# Altium project M4QIDB-PRJ-01.PrjPcb
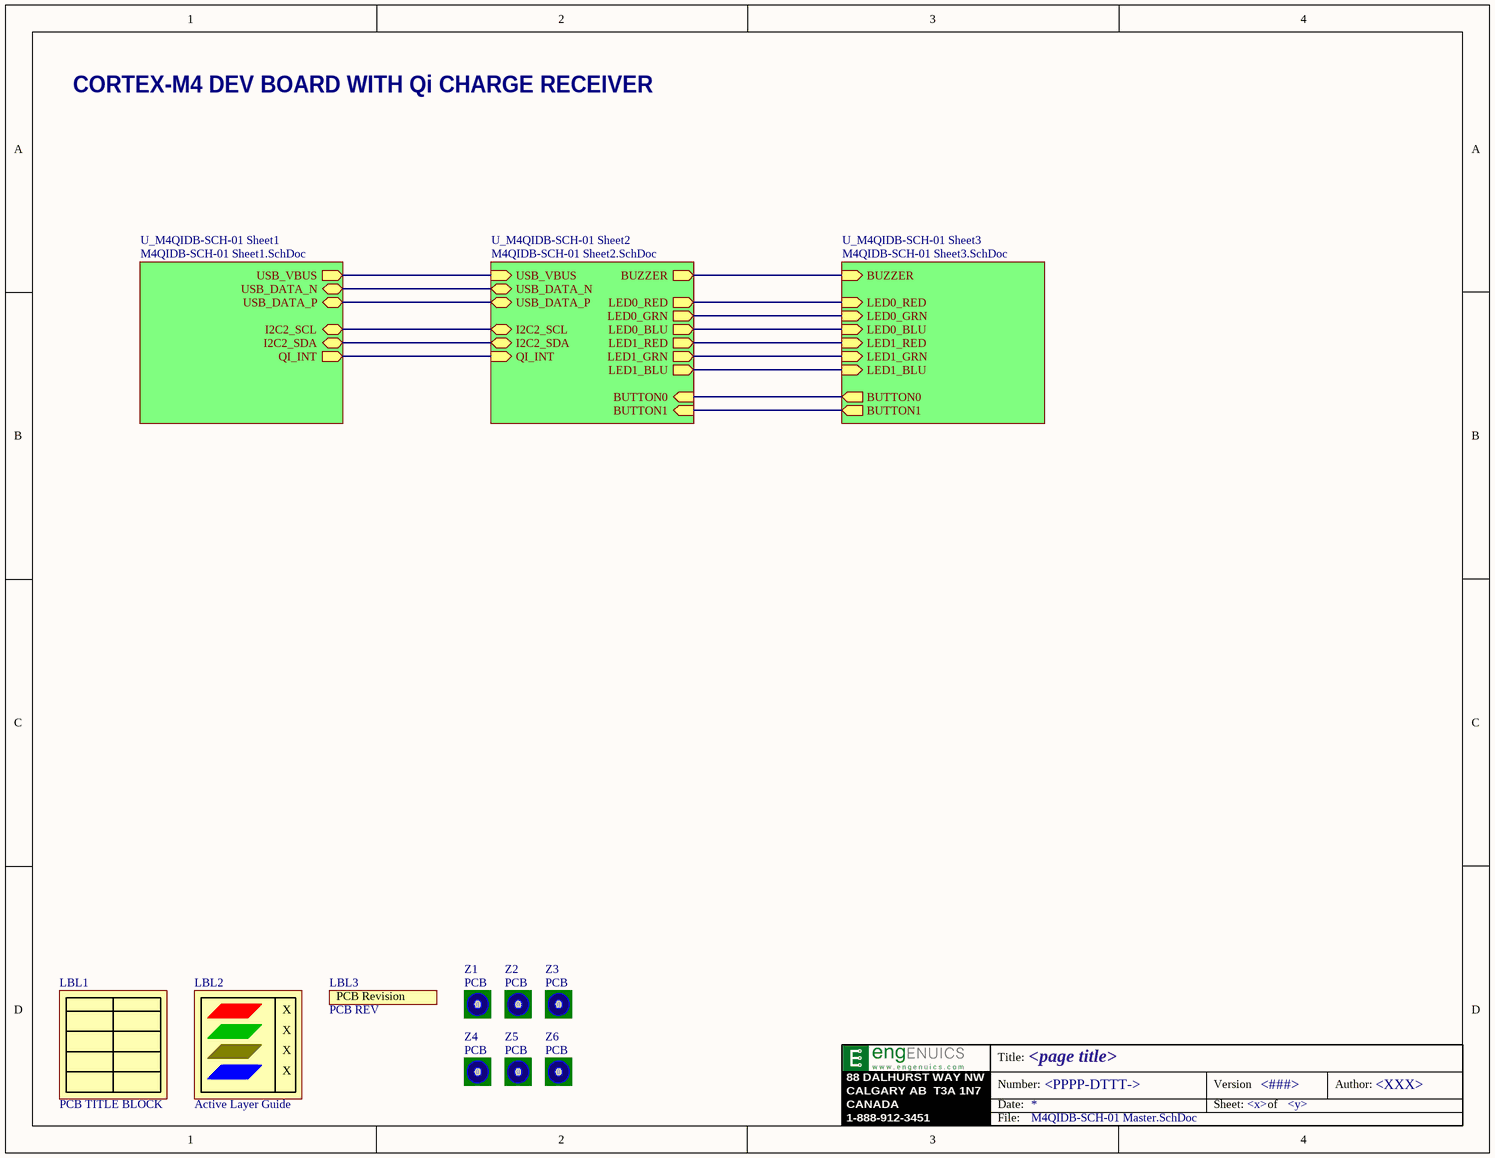
[diagram p0: M4QIDB-SCH-01 Master.SchDoc]
3 sheets, 85 parts. Net scope: hierarchical (ports join the sheet entries above them; power ports are global).
Board file: M4QIDB-PCB-01-DONE.PcbDoc
Sheets:
  M4QIDB-SCH-01 Master.SchDoc
    U_M4QIDB-SCH-01 Sheet1 = M4QIDB-SCH-01 Sheet1.SchDoc
    U_M4QIDB-SCH-01 Sheet2 = M4QIDB-SCH-01 Sheet2.SchDoc

## Sheet M4QIDB-SCH-01 Master.SchDoc: <page title>
size Letter; Author: <XXX>; Organization: Engenuics Technologies Inc; Address1: 88 Dalhurst Way NW; Address2: CALGARY AB; Address3: CANADA T3A 1N7; Address4: 1-888-912-3451; DocumentNumber: <PPPP-DTTT->; Revision: <###>; SheetNumber: <x>; SheetTotal: <y>

### Parts
LBL1  PCB TITLE BLOCK  [LABEL PCB Title Block]  (no BOM)
LBL2  Active Layer Guide  [LABEL PCB ACTIVE LAYERS VERTICAL]  (no BOM)
LBL3  PCB REV  [LABEL PCB REVISION]  (no BOM)
Z1  PCB  [FIDUCIAL PCB]  (no BOM)
Z2  PCB  [FIDUCIAL PCB]  (no BOM)
Z3  PCB  [FIDUCIAL PCB]  (no BOM)
Z4  PCB  [FIDUCIAL PCB]  (no BOM)
Z5  PCB  [FIDUCIAL PCB]  (no BOM)
Z6  PCB  [FIDUCIAL PCB]  (no BOM)

### Sub-sheets
U_M4QIDB-SCH-01 Sheet1 = M4QIDB-SCH-01 Sheet1.SchDoc: USB_DATA_N (bidir), USB_DATA_P (bidir), USB_VBUS (out), I2C2_SCL (bidir), I2C2_SDA (bidir), QI_INT (out)
U_M4QIDB-SCH-01 Sheet2 = M4QIDB-SCH-01 Sheet2.SchDoc: USB_DATA_N (bidir), USB_DATA_P (bidir), USB_VBUS (in), BUZZER (out), BUTTON0 (in), BUTTON1 (in), LED0_RED (out), LED1_RED (out), LED0_BLU (out), LED1_BLU (out), LED0_GRN (out), LED1_GRN (out), I2C2_SCL (bidir), I2C2_SDA (bidir), QI_INT (in)
U_M4QIDB-SCH-01 Sheet3 = M4QIDB-SCH-01 Sheet3.SchDoc (file not in this document): BUTTON1 (out), BUTTON0 (out), LED0_RED (in), LED1_RED (in), LED0_BLU (in), LED1_BLU (in), LED0_GRN (in), LED1_GRN (in), BUZZER (in)

### Nets
BUTTON0: sheet U_M4QIDB-SCH-01 Sheet2/BUTTON0, sheet U_M4QIDB-SCH-01 Sheet3/BUTTON0
BUTTON1: sheet U_M4QIDB-SCH-01 Sheet2/BUTTON1, sheet U_M4QIDB-SCH-01 Sheet3/BUTTON1
BUZZER: sheet U_M4QIDB-SCH-01 Sheet2/BUZZER, sheet U_M4QIDB-SCH-01 Sheet3/BUZZER
I2C2_SCL: sheet U_M4QIDB-SCH-01 Sheet1/I2C2_SCL, sheet U_M4QIDB-SCH-01 Sheet2/I2C2_SCL
I2C2_SDA: sheet U_M4QIDB-SCH-01 Sheet1/I2C2_SDA, sheet U_M4QIDB-SCH-01 Sheet2/I2C2_SDA
LED0_BLU: sheet U_M4QIDB-SCH-01 Sheet2/LED0_BLU, sheet U_M4QIDB-SCH-01 Sheet3/LED0_BLU
LED0_GRN: sheet U_M4QIDB-SCH-01 Sheet2/LED0_GRN, sheet U_M4QIDB-SCH-01 Sheet3/LED0_GRN
LED0_RED: sheet U_M4QIDB-SCH-01 Sheet2/LED0_RED, sheet U_M4QIDB-SCH-01 Sheet3/LED0_RED
LED1_BLU: sheet U_M4QIDB-SCH-01 Sheet2/LED1_BLU, sheet U_M4QIDB-SCH-01 Sheet3/LED1_BLU
LED1_GRN: sheet U_M4QIDB-SCH-01 Sheet2/LED1_GRN, sheet U_M4QIDB-SCH-01 Sheet3/LED1_GRN
LED1_RED: sheet U_M4QIDB-SCH-01 Sheet2/LED1_RED, sheet U_M4QIDB-SCH-01 Sheet3/LED1_RED
QI_INT: sheet U_M4QIDB-SCH-01 Sheet1/QI_INT, sheet U_M4QIDB-SCH-01 Sheet2/QI_INT
USB_DATA_N: sheet U_M4QIDB-SCH-01 Sheet1/USB_DATA_N, sheet U_M4QIDB-SCH-01 Sheet2/USB_DATA_N
USB_DATA_P: sheet U_M4QIDB-SCH-01 Sheet1/USB_DATA_P, sheet U_M4QIDB-SCH-01 Sheet2/USB_DATA_P
USB_VBUS: sheet U_M4QIDB-SCH-01 Sheet1/USB_VBUS, sheet U_M4QIDB-SCH-01 Sheet2/USB_VBUS

### Notes on the sheet
- CORTEX-M4 DEV BOARD WITH Qi CHARGE RECEIVER
- 88 DALHURST WAY NW
- CALGARY AB  T3A 1N7
- CANADA
- Title:
- Number:
- Date:
- Version
- Sheet:
- of
- Author:
- 1-888-912-3451
- File:
- (in symbol LABEL PCB ACTIVE LAYERS) X
- (in symbol LABEL PCB REVISION) PCB Revision

### Library data of the parts
LBL1 = LABEL PCB TITLE BLOCK: 1. Description: LABEL PCB TITLE BLOCK
LBL2 = LABEL PCB ACTIVE LAYERS: 1. Description: LABEL PCB ACTIVE LAYERS; 6. Last Modified: *; 7. Modified By: *
LBL3 = LABEL PCB REVISION: 1. Description: LABEL PCB ENGENUICS
Z1-Z6 = FIDUCIAL PCB: 1. Description: FIDUCIAL SINGLE LAYER PADS ONLY; 2. Manufacturer: *; 3. Manufacturer Part Number: *; 4. Digi-Key Part Number: *

## Sheet M4QIDB-SCH-01 Sheet1.SchDoc: Power supply, Qi Charger
size Letter; Author: JRL; Organization: Engenuics Technologies Inc; Address1: 88 Dalhurst Way NW; Address2: CALGARY AB; Address3: CANADA T3A 1N7; Address4: 1-888-912-3451; DocumentNumber: M4QIDB-SCH; Revision: 01; SheetNumber: 1; SheetTotal: 3
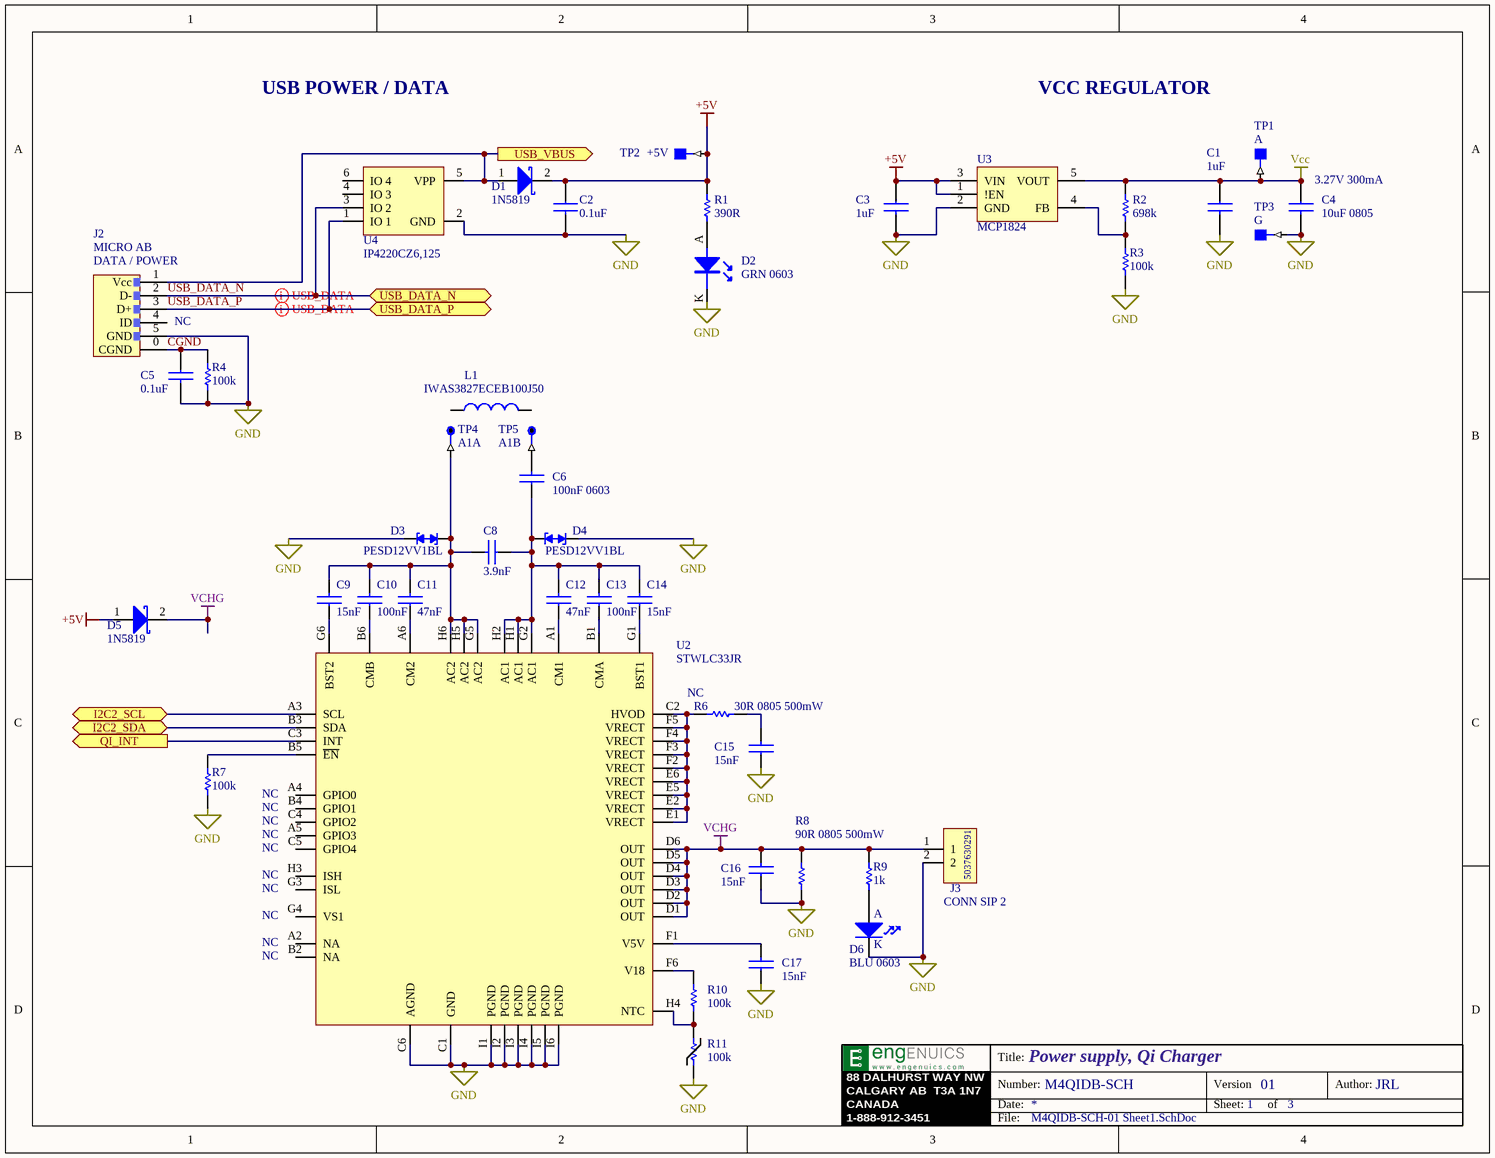
[diagram p1: M4QIDB-SCH-01 Sheet1.SchDoc]

### Parts
C1  1uF  [0603 CAP3D]
C2  0.1uF  [0603 CAP3D]
C3  1uF  [0603 CAP3D]
C4  10uF 0805  [0805 CAP3D]
C5  0.1uF  [0603 CAP3D]
C6  100nF 0603  [0603 CAP3D]
C8  3.9nF  [0603 CAP3D]
C9  15nF  [0603 CAP3D]
C10  100nF  [0603 CAP3D]
C11  47nF  [0603 CAP3D]
C12  47nF  [0603 CAP3D]
C13  100nF  [0603 CAP3D]
C14  15nF  [0603 CAP3D]
C15  15nF  [0603 CAP3D]
C16  15nF  [0603 CAP3D]
C17  15nF  [0603 CAP3D]
D1  1N5819  [SOD123]
D2  GRN 0603  [0603 AK]
D3  PESD12VV1BL  [SOD882]
D4  PESD12VV1BL  [SOD882]
D5  1N5819  [SOD123]
D6  BLU 0603  [0603 AK]
J2  MICRO AB  [CONN USB MICRO B SMT LEGS FCI 10118193]
J3  CONN SIP 2  [HDR1X2]
L1  IWAS3827ECEB100J50  [HDR1X2 NP]  (mechanical)
R1  390R  [0603]
R2  698k  [0603]
R3  100k  [0603]
R4  100k  [0603]
R6  30R 0805 500mW  [0805]
R7  100k  [0603]
R8  90R 0805 500mW  [0805]
R9  1k  [0603]
R10  100k  [0603]
R11  100k  [0603]
TP1  A  [TEST POINT SMT]  (no BOM)
TP2  +5V  [TEST POINT SMT]  (no BOM)
TP3  G  [TEST POINT SMT]  (no BOM)
TP4  A1A  [TEST POINT THRU HOLE]  (no BOM)
TP5  A1B  [TEST POINT THRU HOLE]  (no BOM)
U2  STWLC33JR  [FLIP CHIP 3.97x2.67mm]
U3  MCP1824  [SOT23-5]
U4  IP4220CZ6,125  [TSOP95P280X110-6N]

### Ports
I2C2_SCL (bidir), I2C2_SDA (bidir), QI_INT (out), USB_DATA_N (bidir), USB_DATA_P (bidir), USB_VBUS (out)

### Nets
+5V: C2.1 C3.1 D1.2 D5.1 R1.2 TP2.1 U3.1(!EN) U3.3(VIN)
GND: C1.2 C2.2 C3.2 C4.2 C5.2 C15.1 C16.1 C17.1 D2.K(K1) D3.2 D4.2 D6.K J2.5(GND) J3.2 R3.2 R4.1 R7.2 R8.2 R11.2 TP3.1 U2.C1(GND) U2.C6(AGND) U2.I1(PGND) U2.I2(PGND) U2.I3(PGND) U2.I4(PGND) U2.I5(PGND) U2.I6(PGND) U3.2(GND) U4.2(GND)
Vcc: C1.1 C4.1 R2.2 TP1.1 U3.5(VOUT)
VCHG: C16.2 D5.2 J3.1 R8.1 R9.1 U2.D1(OUT) U2.D2(OUT) U2.D3(OUT) U2.D4(OUT) U2.D5(OUT) U2.D6(OUT)
CGND: C5.1 J2.0(CGND) R4.2
I2C2_SCL: U2.A3(SCL) ; port I2C2_SCL
I2C2_SDA: U2.B3(SDA) ; port I2C2_SDA
QI_INT: U2.C3(INT) ; port QI_INT
USB_DATA_N: J2.2(D-) U4.3(IO_2) ; port USB_DATA_N
USB_DATA_P: J2.3(D+) U4.1(IO_1) ; port USB_DATA_P
USB_VBUS: D1.1 J2.1(Vcc) U4.5(VPP) ; port USB_VBUS
NetC6_1: C6.1 C8.1 C12.2 C13.2 C14.2 D4.1 U2.G2(AC1) U2.H1(AC1) U2.H2(AC1)
NetC6_2: C6.2 TP5.1
NetC8_2: C8.2 C9.2 C10.2 C11.2 D3.1 TP4.1 U2.G5(AC2) U2.H5(AC2) U2.H6(AC2)
NetC9_1: C9.1 U2.G6(BST2)
NetC10_1: C10.1 U2.B6(CMB)
NetC11_1: C11.1 U2.A6(CM2)
NetC12_1: C12.1 U2.A1(CM1)
NetC13_1: C13.1 U2.B1(CMA)
NetC14_1: C14.1 U2.G1(BST1)
NetC15_2: C15.2 R6.2
NetC17_2: C17.2 U2.F1(V5V)
NetD2_A: D2.A(A1) R1.1
NetD6_A: D6.A R9.2
NetR2_1: R2.1 R3.1 U3.4(FB)
NetR6_1: R6.1 U2.C2(HVOD) U2.E1(VRECT) U2.E2(VRECT) U2.E5(VRECT) U2.E6(VRECT) U2.F2(VRECT) U2.F3(VRECT) U2.F4(VRECT) U2.F5(VRECT)
NetR7_1: R7.1 U2.B5(~{EN})
NetR10_1: R10.1 U2.F6(V18)
NetR10_2: R10.2 R11.1 U2.H4(NTC)

Not connected (* = marked no-connect by the designer): J2 4(ID); L1 1 2; U2 A2(NA) A4(GPIO0) A5(GPIO3) B2(NA) B4(GPIO1) C4(GPIO2) C5(GPIO4) G3(ISL) G4(VS1) H3(ISH); U4 4(IO_3) 6(IO_4)

### Layout directives
differential pair: USB_DATA_N, USB_DATA_P

### Notes on the sheet
- USB POWER / DATA
- VCC REGULATOR
- (near C4) 3.27V 300mA
- (near J2) DATA / POWER
- NC
- (near R6) NC
- (near U2) NC
- 88 DALHURST WAY NW
- CALGARY AB  T3A 1N7
- CANADA
- Title:
- Number:
- Date:
- Version
- Sheet:
- of
- Author:
- 1-888-912-3451
- File:

### Library data of the parts
C1 C3 = CAPACITOR NON-POLARIZED: 3. Manufacturer Part Number: EMK107BJ105KA-T; 2. Manufacturer: Taiyo; 5. Internal Part Number: 100009; 1. Description: CAP CER 1uF 10% X5R 16V 0603 SMT; 7. Modified By: JRL; 4. Digi-Key Part Number: 587-1251-2-ND; 6. Last Modified: 2016-08-04
C2 C5 = CAPACITOR NON-POLARIZED: 3. Manufacturer Part Number: C1608X7R1E104K; 2. Manufacturer: TDK; 5. Internal Part Number: 100130; 1. Description: CAP CER 0.1uF 10% X5R 25V 0603 SMT; 7. Modified By: JRL; 4. Digi-Key Part Number: 445-1316-2-ND; 6. Last Modified: 2016-08-04
C4 = CAPACITOR NON-POLARIZED: 3. Manufacturer Part Number: CL21A106KOQNNNE; 2. Manufacturer: Samsung; 5. Internal Part Number: 100006; 1. Description: CAP CER 10uF 10% 16V X5R 0805; 7. Modified By: JRL; 4. Digi-Key Part Number: 1276-1096-1-ND; 6. Last Modified: 2016-08-04
C6 = CAPACITOR NON-POLARIZED: 3. Manufacturer Part Number: CC0603KRX7R9BB473; 2. Manufacturer: Yageo; 1. Description: CAP CER 0.047UF 50V X7R 0603; 7. Modified By: JRL; 5. Internal Part Number: *; 4. Digi-Key Part Number: 311-1427-2-ND; 6. Last Modified: 2019-01-20
C8 = CAPACITOR NON-POLARIZED: 3. Manufacturer Part Number: CAP CER 3900PF 50V X7R 0402 NEED CROSS; 2. Manufacturer: Murata Electronics North America; 1. Description: CAP CER 3900PF 50V X7R 0402; 7. Modified By: JRL; 5. Internal Part Number: *; 4. Digi-Key Part Number: 490-1307-2-ND; 6. Last Modified: 2019-01-20
C9 C14-C17 = CAPACITOR NON-POLARIZED: 3. Manufacturer Part Number: C0402C153K8PACTU; 2. Manufacturer: KEMET; 1. Description: CAP CER 0.015UF 10V X5R 0402; 7. Modified By: JRL; 5. Internal Part Number: *; 4. Digi-Key Part Number: 399-3011-2-ND; 6. Last Modified: 2019-01-20
C10 C13 = CAPACITOR NON-POLARIZED: 3. Manufacturer Part Number: GRM155R61H104KE14D; 2. Manufacturer: Murata Electronics North America; 1. Description: CAP CER 0.1UF 50V X5R 0402; 7. Modified By: JRL; 5. Internal Part Number: *; 4. Digi-Key Part Number: 490-10697-2-ND; 6. Last Modified: 2019-01-20
C11 C12 = CAPACITOR NON-POLARIZED: 3. Manufacturer Part Number: GRM155R61H473KE19 NEED CROSS; 2. Manufacturer: Murata Electronics North America; 1. Description: CAP CER 0.047UF 50V X5R 0402; 7. Modified By: JRL; 5. Internal Part Number: *; 4. Digi-Key Part Number: 490-12705-2-ND; 6. Last Modified: 2019-01-20
D1 D5 = DIODE SCHOTTKY: 2. Manufacturer: Diodes Inc.; 3. Manufacturer Part Number: 1N5819HW-7-F; 5. Internal Part Number: 100039; 1. Description: DIODE SCHOTTKY 1A 40V SOD123; 7. Modified By: JRL; 4. Digi-Key Part Number: 1N5819HW-FDITR-ND; 6. Last Modified: 2016-08-04
D2 = LED T1-3/4: LED; 2. Manufacturer: Kingbright Corp; 3. Manufacturer Part Number: APT1608SGC; 5. Internal Part Number: 100065; 1. Description: LED 0603 GREEN CLEAR SMD; 7. Modified By: JRL; 4. Digi-Key Part Number: 754-1121-2-ND; 6. Last Modified: 2016-08-04
D3 D4 = DIODE ESD PESD12VVBL: 2. Manufacturer: Nexperia USA Inc.; 3. Manufacturer Part Number: PESD12VV1BL,315; 1. Description: TVS DIODE 12V 38V DFN1006-2; 7. Modified By: JRL; 4. Digi-Key Part Number: 1727-1304-2-ND; 5. Internal Part Number: *; 6. Last Modified: 2019-01-20
D6 = LED AK: 2. Manufacturer: Kingbright; 3. Manufacturer Part Number: APT1608QBC/D; 5. Internal Part Number: 100107; 1. Description: LED 0603 BLUE 470NM WTR CLR SMD; 7. Modified By: JRL; 4. Digi-Key Part Number: 754-1434-1-ND; 6. Last Modified: 2019-01-20
J2 = CONN USB MICRO AB FCI 10104111: 2. Manufacturer: FCI; 3. Manufacturer Part Number: 10104111-0001LF; 5. Internal Part Number: 100182; 1. Description: CONN RCPT STD MICRO USB TYPE AB; 7. Modified By: JRL; 4. Digi-Key Part Number: 609-4053-1-ND; 6. Last Modified: 2012-09-03
J3 = CONN 2POS MOLEX 5037630291: 2. Manufacturer: MOLEX; 1. Description: CONN HEADER 1MM R/A 2CKT; 7. Modified By: JRL; 3. Manufacturer Part Number: 5037630291; 4. Digi-Key Part Number: WM10654TR-ND; 5. Internal Part Number: *; 6. Last Modified: 2015-12-08
L1 = INDUCTOR: 1. Description: INDUCTOR [TYPE] [VALUE] [TOLERANCE] [PACKAGE] [CURRENT] [DCR]; 2. Manufacturer: *; 3. Manufacturer Part Number: *; 4. Digi-Key Part Number: *; 5. Internal Part Number: *; 6. Last Modified: *; 7. Modified By: *
R1 = RESISTOR: 2. Manufacturer: Yageo; 3. Manufacturer Part Number: RC0603FR-07390RL; 5. Internal Part Number: 100098; 1. Description: RES 390 OHM 1/10W 1% 0603; 7. Modified By: JRL; 4. Digi-Key Part Number: 311-390HRTR-ND; 6. Last Modified: 2013-06-26
R2 = RESISTOR: 2. Manufacturer: Yageo; 3. Manufacturer Part Number: RC0603FR-07698KL; 1. Description: RES 698K OHM 1/10W 1% 0603 SMD; 7. Modified By: JRL; 4. Digi-Key Part Number: 311-698KHRCT-ND; 6. Last Modified: 2011-08-14
R3 R4 = RESISTOR: 2. Manufacturer: Yageo; 3. Manufacturer Part Number: RC0603FR-07100KL; 5. Internal Part Number: 100078; 1. Description: RES 100K OHM 1/10W 1% 0603 SMD; 7. Modified By: JRL; 4. Digi-Key Part Number: 311-100KHRTR-ND; 6. Last Modified: 2016-08-04
R6 R8 = RESISTOR: 2. Manufacturer: Panasonic Electronic Components; 3. Manufacturer Part Number: ERJ-P6WF30R0V; 1. Description: RES SMD 30 OHM 1% 1/2W 0805; 7. Modified By: JRL; 5. Internal Part Number: *; 4. Digi-Key Part Number: ERJ-P6WF30R0V-ND; 6. Last Modified: 2018-11-22
R7 R9-R11 = RESISTOR: 1. Description: RES [VALUE] [POWER] [TOLERANCE] [PACKAGE] [CONSTRUCTION]; 5. Internal Part Number: *; 4. Digi-Key Part Number: *; 2. Manufacturer: *; 3. Manufacturer Part Number: *; 6. Last Modified: *; 7. Modified By: *
TP1-TP3 = TEST POINT SMT: 1. Description: Test pad; 7. Modified By: JRL; 2. Manufacturer: N/A; 3. Manufacturer Part Number: N/A; 4. Digi-Key Part Number: N/A
  TP1 TP3: 6. Last Modified: 2012-12-16
  TP2: 5. Internal Part Number: N/A; 6. Last Modified: June 12, 2008
TP4 TP5 = TEST POINT THRU HOLE: 1. Description: TEST PAD THROUGH-HOLE; 7. Modified By: JRL; 2. Manufacturer: N/A; 3. Manufacturer Part Number: N/A; 4. Digi-Key Part Number: N/A; 5. Internal Part Number: N/A; 6. Last Modified: June 12, 2008
U2 = IC WIRESLESS CHARGER STWLC33JR: 2. Manufacturer: STM; 1. Description: IC WIRELESS POWER RECEIVER 52CSP; 7. Modified By: JRL; 3. Manufacturer Part Number: STWLC33JR; 4. Digi-Key Part Number: 497-17649-2-ND; 5. Internal Part Number: *; 6. Last Modified: 2019-01-20
U3 = VREG MCP1824: 2. Manufacturer: Microchip; 3. Manufacturer Part Number: MCP1824T-ADJE/OT; 1. Description: IC LDO REG 300MA ADJ-V SOT23-5; 7. Modified By: JRL; 4. Digi-Key Part Number: MCP1824T-ADJE/OTCT-ND; 6. Last Modified: 2011-08-14
U4 = IC ESD USB DUAL NXP IP4220CZ6: 2. Manufacturer: NXP; 5. Internal Part Number: 100225; 1. Description: IC USB DUAL ESD PROTECT 6TSOP; 7. Modified By: JRL; 3. Manufacturer Part Number: IP4220CZ6,125; 4. Digi-Key Part Number: 568-3529-6-ND; 6. Last Modified: 2013-05-14

## Sheet M4QIDB-SCH-01 Sheet2.SchDoc: Microcontroller
size Letter; Author: JRL; Organization: Engenuics Technologies Inc; Address1: 88 Dalhurst Way NW; Address2: CALGARY AB; Address3: CANADA T3A 1N7; Address4: 1-888-912-3451; DocumentNumber: M4QIDB-SCH; Revision: 1; SheetNumber: 2; SheetTotal: 3
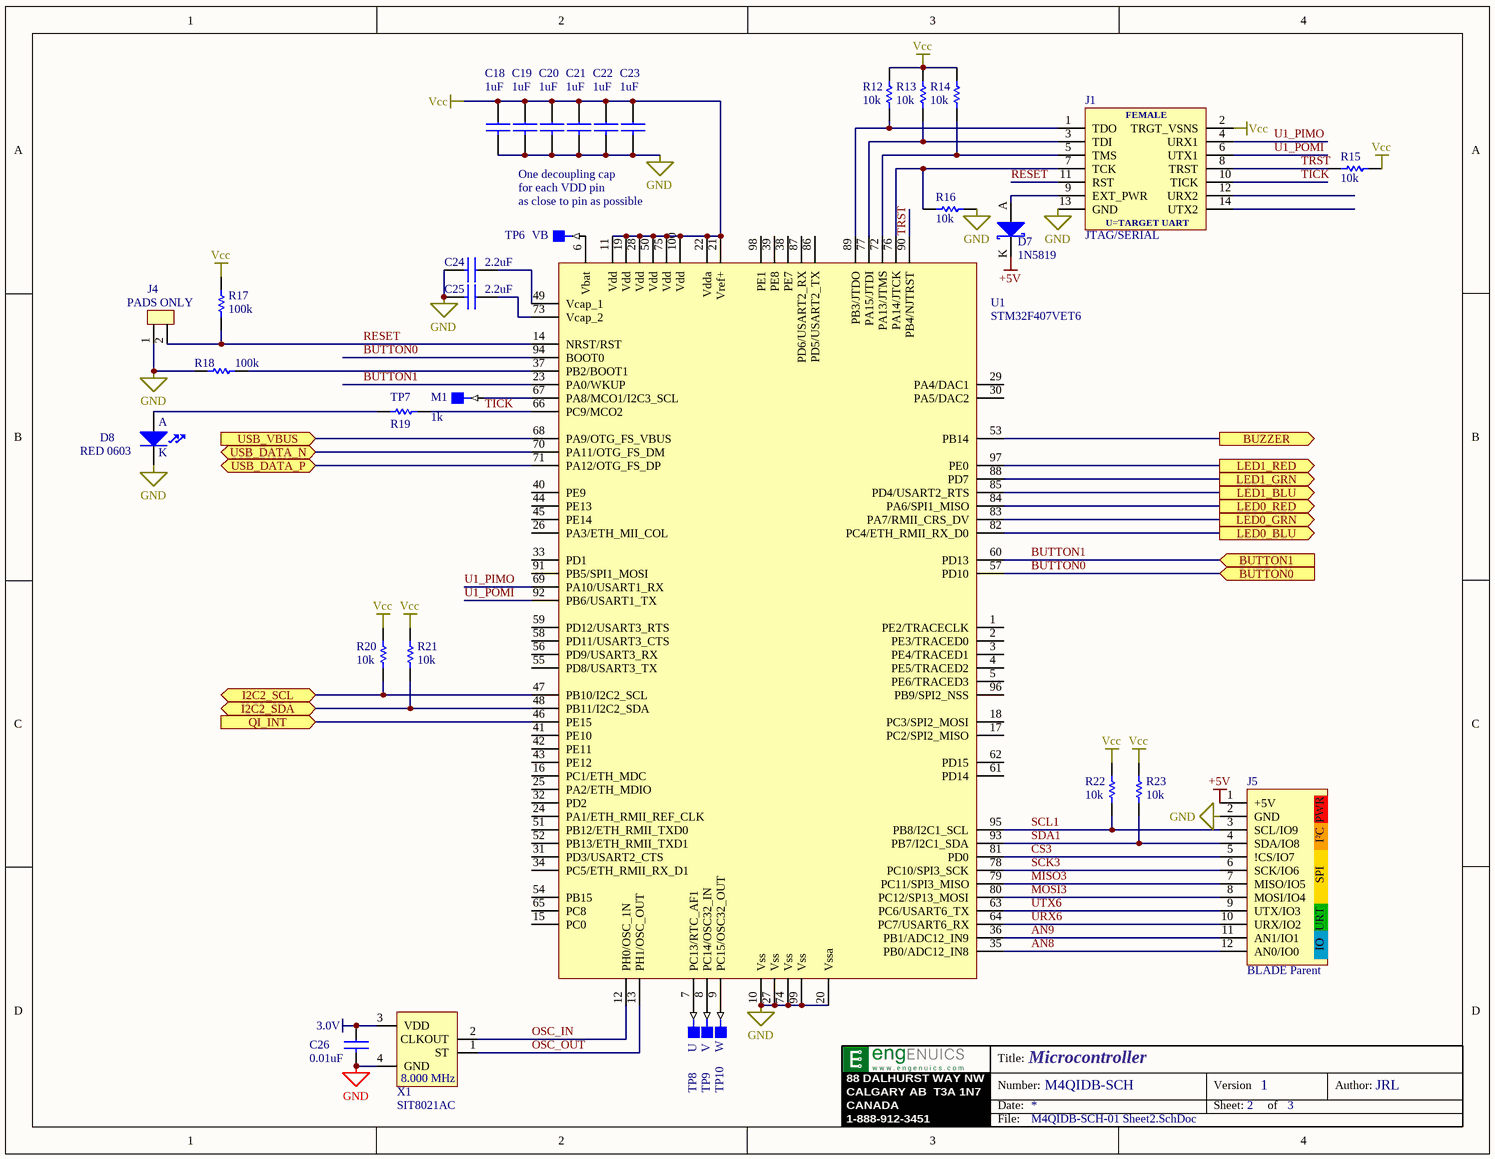
[diagram p2: M4QIDB-SCH-01 Sheet2.SchDoc]

### Parts
C18  1uF  [0603 CAP3D]
C19  1uF  [0603 CAP3D]
C20  1uF  [0603 CAP3D]
C21  1uF  [0603 CAP3D]
C22  1uF  [0603 CAP3D]
C23  1uF  [0603 CAP3D]
C24  2.2uF  [0603 CAP3D]
C25  2.2uF  [0603 CAP3D]
C26  0.01uF  [0603 CAP3D]
D7  1N5819  [SOD123 AK]
D8  RED 0603  [0603 AK]
J1  JTAG/SERIAL  [CONN 14POS 7X2 SMT FEMALE]
J4  PADS ONLY  [HDR1X2]  (no BOM)
J5  BLADE Parent  [HDR1X12 ENGENUICS PARENT]
R12  10k  [0603]
R13  10k  [0603]
R14  10k  [0603]
R15  10k  [0603]
R16  10k  [0603]
R17  100k  [0603]
R18  100k  [0603]
R19  1k  [0603]
R20  10k  [0603]
R21  10k  [0603]
R22  10k  [0603]
R23  10k  [0603]
TP6  VB  [TEST POINT SMT]  (no BOM)
TP7  M1  [TEST POINT SMT]  (no BOM)
TP8  U  [TEST POINT SMT]  (no BOM)
TP9  V  [TEST POINT SMT]  (no BOM)
TP10  W  [TEST POINT SMT]  (no BOM)
U1  STM32F407VET6  [LQFP100]
X1  SIT8021AC  [CSP 1.55mm x 0.85mm]

### Ports
BUTTON0 (in), BUTTON1 (in), BUZZER (out), I2C2_SCL (bidir), I2C2_SDA (bidir), LED0_BLU (out), LED0_GRN (out), LED0_RED (out), LED1_BLU (out), LED1_GRN (out), LED1_RED (out), QI_INT (in), USB_DATA_N (bidir), USB_DATA_P (bidir), USB_VBUS (in)

### Nets
3.0V: C26.1 X1.3(VDD)
+5V: D7.K J5.1(+5V)
GND: C18.2 C19.2 C20.2 C21.2 C22.2 C23.2 C24.2 C25.2 C26.2 D8.K J1.13(GND) J4.1 J5.2(GND) R16.1 R18.2 U1.10(Vss) U1.20(Vssa) U1.27(Vss) U1.74(Vss) U1.99(Vss) X1.4(GND)
Vcc: C18.1 C19.1 C20.1 C21.1 C22.1 C23.1 J1.2(TRGT_VSNS) R12.2 R13.2 R14.2 R15.1 R17.2 R20.2 R21.2 R22.2 R23.2 U1.11(Vdd) U1.19(Vdd) U1.21(Vref+) U1.22(Vdda) U1.28(Vdd) U1.50(Vdd) U1.75(Vdd) U1.100(Vdd)
AN8: J5.12(AN0/IO0) U1.35(PB0/ADC12_IN8)
AN9: J5.11(AN1/IO1) U1.36(PB1/ADC12_IN9)
BUTTON0: U1.57(PD10) U1.94(BOOT0) ; port BUTTON0
BUTTON1: U1.23(PA0/WKUP) U1.60(PD13) ; port BUTTON1
BUZZER: U1.53(PB14) ; port BUZZER
CS3: J5.5(!CS/IO7) U1.81(PD0)
I2C2_SCL: R20.1 U1.47(PB10/I2C2_SCL) ; port I2C2_SCL
I2C2_SDA: R21.1 U1.48(PB11/I2C2_SDA) ; port I2C2_SDA
LED0_BLU: U1.82(PC4/ETH_RMII_RX_D0) ; port LED0_BLU
LED0_GRN: U1.83(PA7/RMII_CRS_DV) ; port LED0_GRN
LED0_RED: U1.84(PA6/SPI1_MISO) ; port LED0_RED
LED1_BLU: U1.85(PD4/USART2_RTS) ; port LED1_BLU
LED1_GRN: U1.88(PD7) ; port LED1_GRN
LED1_RED: U1.97(PE0) ; port LED1_RED
MISO3: J5.7(MISO/IO5) U1.79(PC11/SPI3_MISO)
MOSI3: J5.8(MOSI/IO4) U1.80(PC12/SP13_MOSI)
OSC_IN: U1.12(PH0/OSC_1N) X1.2(CLKOUT)
OSC_OUT: U1.13(PH1/OSC_OUT) X1.1(ST)
QI_INT: U1.46(PE15) ; port QI_INT
RESET: J1.11(RST) J4.2 R17.1 U1.14(NRST/RST)
SCK3: J5.6(SCK/IO6) U1.78(PC10/SPI3_SCK)
SCL1: J5.3(SCL/IO9) R22.1 U1.95(PB8/I2C1_SCL)
SDA1: J5.4(SDA/IO8) R23.1 U1.93(PB7/I2C1_SDA)
TICK: J1.10(TICK) R19.2 U1.66(PC9/MCO2)
TRST: J1.8(TRST) R15.2 U1.90(PB4/NJTRST)
U1_PIMO: J1.4(URX1) U1.69(PA10/USART1_RX)
U1_POMI: J1.6(UTX1) U1.92(PB6/USART1_TX)
URX6: J5.10(URX/IO2) U1.64(PC7/USART6_RX)
USB_DATA_N: U1.70(PA11/OTG_FS_DM) ; port USB_DATA_N
USB_DATA_P: U1.71(PA12/OTG_FS_DP) ; port USB_DATA_P
USB_VBUS: U1.68(PA9/OTG_FS_VBUS) ; port USB_VBUS
UTX6: J5.9(UTX/IO3) U1.63(PC6/USART6_TX)
NetC24_1: C24.1 U1.49(Vcap_1)
NetC25_1: C25.1 U1.73(Vcap_2)
NetD7_A: D7.A J1.9(EXT_PWR)
NetD8_A: D8.A R19.1
NetJ1_1: J1.1(TDO) R12.1 U1.89(PB3/JTDO)
NetJ1_3: J1.3(TDI) R13.1 U1.77(PA15/JTDI)
NetJ1_5: J1.5(TMS) R14.1 U1.72(PA13/JTMS)
NetJ1_7: J1.7(TCK) R16.2 U1.76(PA14/JTCK)
NetR18_1: R18.1 U1.37(PB2/BOOT1)
NetTP6_1: TP6.1 U1.6(Vbat)
NetTP7_1: TP7.1 U1.67(PA8/MCO1/I2C3_SCL)
NetTP8_1: TP8.1 U1.7(PC13/RTC_AF1)
NetTP9_1: TP9.1 U1.8(PC14/OSC32_IN)
NetTP10_1: TP10.1 U1.9(PC15/OSC32_OUT)

Not connected (* = marked no-connect by the designer): J1 12(URX2) 14(UTX2); U1 1(PE2/TRACECLK) 2(PE3/TRACED0) 3(PE4/TRACED1) 4(PE5/TRACED2) 5(PE6/TRACED3) 15(PC0) 16(PC1/ETH_MDC) 17(PC2/SPI2_MISO) 18(PC3/SPI2_MOSI) 24(PA1/ETH_RMII_REF_CLK) 25(PA2/ETH_MDIO) 26(PA3/ETH_MII_COL) 29(PA4/DAC1) 30(PA5/DAC2) 31(PD3/USART2_CTS) 32(PD2) 33(PD1) 34(PC5/ETH_RMII_RX_D1) 38(PE7) 39(PE8) 40(PE9) 41(PE10) 42(PE11) 43(PE12) 44(PE13) 45(PE14) 51(PB12/ETH_RMII_TXD0) 52(PB13/ETH_RMII_TXD1) 54(PB15) 55(PD8/USART3_TX) 56(PD9/USART3_RX) 58(PD11/USART3_CTS) 59(PD12/USART3_RTS) 61(PD14) 62(PD15) 65(PC8) 86(PD5/USART2_TX) 87(PD6/USART2_RX) 91(PB5/SPI1_MOSI) 96(PB9/SPI2_NSS) 98(PE1)

### Notes on the sheet
- One decoupling cap
- for each VDD pin
- (near TP6) as close to pin as possible
- 88 DALHURST WAY NW
- CALGARY AB  T3A 1N7
- CANADA
- Title:
- Number:
- Date:
- Version
- Sheet:
- of
- Author:
- 1-888-912-3451
- File:
- (in symbol CONN ENGENUICS BLADE PARENT) PWR; I²C; SPI; URT; IO
- (in symbol CONN JTAG/SERIAL DEBUG 14POS FEMALE ENGENUICS) FEMALE; U=TARGET UART
- (in symbol IC OSCILLATOR SIT8021AC) 8.000 MHz

### Library data of the parts
C18-C23 = CAPACITOR NON-POLARIZED: as C1 on sheet M4QIDB-SCH-01 Sheet1; 4. Digi-Key Part Number: 587-1251-2-ND; 6. Last Modified: 2016-08-04
C24 C25 = CAPACITOR NON-POLARIZED: 3. Manufacturer Part Number: 445-5157-1-ND; 2. Manufacturer: TDK Corporation; 1. Description: CAP CER 2.2uF 10% X5R 16V 0603 SMT; 7. Modified By: JRL; 4. Digi-Key Part Number: C1608X5R1C225K/0.80; 6. Last Modified: 2016-08-04
C26 = CAPACITOR NON-POLARIZED: 3. Manufacturer Part Number: CL05B103KO5NNNC; 2. Manufacturer: Samsung; 1. Description: CAP CER 10000PF 16V X7R 0402; 7. Modified By: JRL; 5. Internal Part Number: *; 4. Digi-Key Part Number: 1276-1051-2-ND; 6. Last Modified: 2018-12-14
D7 = DIODE SCHOTTKY AK: 2. Manufacturer: Diodes Inc.; 3. Manufacturer Part Number: 1N5819HW-7-F; 5. Internal Part Number: 100039; 1. Description: DIODE SCHOTTKY 1A 40V SOD123; 7. Modified By: JRL; 4. Digi-Key Part Number: 1N5819HW-FDITR-ND; 6. Last Modified: 2016-07-31
D8 = LED AK: 2. Manufacturer: Kingbright Corp; 3. Manufacturer Part Number: APT1608SRCPRV; 1. Description: LED RED CLEAR 0603 SMD; 7. Modified By: JRL; 4. Digi-Key Part Number: 754-1122-2-ND; 6. Last Modified: 2012-12-18
J1 = CONN JTAG/SERIAL DEBUG 14POS FEMALE ENGENUICS: 2. Manufacturer: Samtec; 3. Manufacturer Part Number: FLE-107-01-G-DV; 1. Description: CONN RCPT .05" 14POS DUAL SMD; 7. Modified By: JRL; 4. Digi-Key Part Number: SAM1226-07-ND; 6. Last Modified: 2011-06-10
J4 = CONN SIP 2: 2. Manufacturer: *; 3. Manufacturer Part Number: *; 1. Description: PADS; 4. Digi-Key Part Number: *
J5 = CONN ENGENUICS BLADE PARENT: 2. Manufacturer: Sullins; 3. Manufacturer Part Number: PPTC121LGBN-RC; 5. Internal Part Number: 100031; 1. Description: CONN TERMINAL 12POS 0.100" RIGHT ANGLE; 7. Modified By: JRL; 4. Digi-Key Part Number: S5448-ND; 6. Last Modified: 2011-04-17
R12-R16 R20-R23 = RESISTOR: 2. Manufacturer: Vishay; 3. Manufacturer Part Number: CRCW060310K0FKEA; 5. Internal Part Number: 100079; 1. Description: RES 10K OHM 1/10W 1% 0603 SMD; 7. Modified By: JRL; 4. Digi-Key Part Number: 541-10.0KHTR-ND; 6. Last Modified: 2016-07-31
R17 R18 = RESISTOR: as R3 on sheet M4QIDB-SCH-01 Sheet1; 4. Digi-Key Part Number: 311-100KHRTR-ND; 6. Last Modified: 2016-08-04
R19 = RESISTOR: 2. Manufacturer: Vishay; 3. Manufacturer Part Number: CRCW06031K00FKEA; 1. Description: RES 1K 1/10W 1% 0603; 7. Modified By: KP; 4. Digi-Key Part Number: 541-1.00KHCT-ND; 6. Last Modified: 2012-12-17
TP6-TP10 = TEST POINT SMT: as TP1 on sheet M4QIDB-SCH-01 Sheet1; 2. Manufacturer: N/A; 3. Manufacturer Part Number: N/A; 4. Digi-Key Part Number: N/A; 6. Last Modified: 2012-12-16
U1 = MCU STM32F407Vx M4QIDB: 2. Manufacturer: ST MICRO; 7. Modified By: JRL; 1. Description: MCU CORTEX-M3 STM32F407Vx LQFP100; 3. Manufacturer Part Number: STM32F407VET6; 4. Digi-Key Part Number: 497-12075-ND; 5. Internal Part Number: *; 6. Last Modified: 2016-06-27
X1 = IC OSCILLATOR SIT8021AC: 2. Manufacturer: SiTIME; 3. Manufacturer Part Number: SiT8021AC-J4-XXS-8.000000D; 1. Description: MEMS OSC XO 32.7680KHZ LVCMOS; 7. Modified By: JRL; 4. Digi-Key Part Number: N/A; 5. Internal Part Number: *; 6. Last Modified: 2018-11-20

## Nets that join several sheets
+5V: M4QIDB-SCH-01 Sheet1 (8 pins), M4QIDB-SCH-01 Sheet2 (D7.K J5.1)
GND: M4QIDB-SCH-01 Sheet1 (30 pins), M4QIDB-SCH-01 Sheet2 (21 pins)
Vcc: M4QIDB-SCH-01 Sheet1 (5 pins), M4QIDB-SCH-01 Sheet2 (24 pins)
I2C2_SCL: M4QIDB-SCH-01 Sheet1 (U2.A3), M4QIDB-SCH-01 Sheet2 (R20.1 U1.47)
I2C2_SDA: M4QIDB-SCH-01 Sheet1 (U2.B3), M4QIDB-SCH-01 Sheet2 (R21.1 U1.48)
QI_INT: M4QIDB-SCH-01 Sheet1 (U2.C3), M4QIDB-SCH-01 Sheet2 (U1.46)
USB_DATA_N: M4QIDB-SCH-01 Sheet1 (J2.2 U4.3), M4QIDB-SCH-01 Sheet2 (U1.70)
USB_DATA_P: M4QIDB-SCH-01 Sheet1 (J2.3 U4.1), M4QIDB-SCH-01 Sheet2 (U1.71)
USB_VBUS: M4QIDB-SCH-01 Sheet1 (D1.1 J2.1 U4.5), M4QIDB-SCH-01 Sheet2 (U1.68)